# Altium schematic sheet RelayBypass.SchDoc
size A4; Author: Jeremiah Lilland; CompanyName: Pinebox Effects; DrawnBy: Jeremiah Lilland; Revision: 1.0
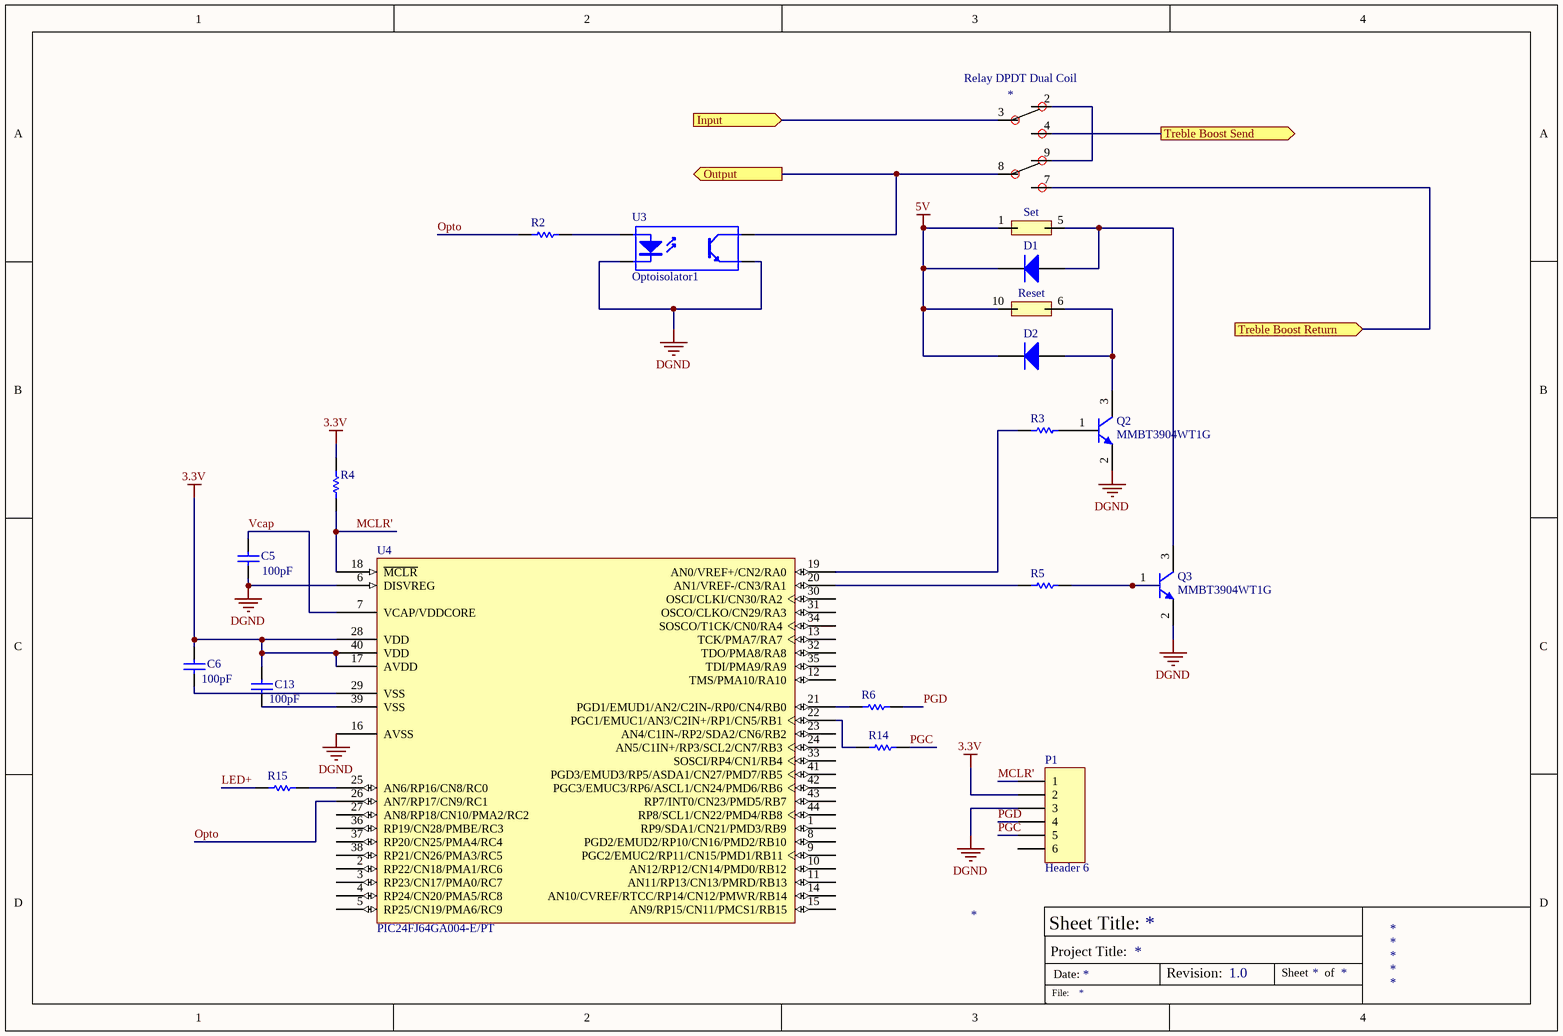
[diagram p0: RelayBypass.SchDoc]

## Parts
*  Relay DPDT Dual Coil  [EB2 Relay]
C5  value 100pF  [1210]  (hidden comment: C1210)
C6  value 100pF  [1206]  (hidden comment: C1206)
C13  value 100pF  [1206]  (hidden comment: C1206)
D1  Diode 1N4148  [DO-35]  (value not drawn)
D2  Diode 1N4148  [DO-35]  (value not drawn)
P1  Header 6  [HDR1X6]
Q2  MMBT3904WT1G  [ONSC-SC-70-3-419-04_V]
Q3  MMBT3904WT1G  [ONSC-SC-70-3-419-04_V]
R2  ERJ6BQ  [6-0805]  (value not drawn)
R3  ERJ6BQ  [6-0805]  (value not drawn)
R4  ERJ6BQ  [6-0805]  (value not drawn)
R5  ERJ6BQ  [6-0805]  (value not drawn)
R6  ERJ6BQ  [6-0805]  (value not drawn)
R14  ERJ6BQ  [6-0805]  (value not drawn)
R15  ERJ6BQ  [6-0805]  (value not drawn)
U3  Optoisolator1  [DIP-4]
U4  PIC24FJ64GA004-E/PT  [TQFP-PT44_N]

## Ports
Input (in), Output (out), Treble Boost Return (in), Treble Boost Send (out)

## Nets
3.3V: C6.2 C13.2 P1.2 R4.2 U4.17(AVDD) U4.28(VDD) U4.40(VDD)
5V: *.1 *.10 D1.2(K) D2.2(K)
DGND: C5.1 P1.3 Q2.2(E) Q3.2(E) U3.2(K) U3.3(E) U4.6(DISVREG) U4.16(AVSS)
Input: *.3 ; port Input
LED+: R15.2
MCLR': P1.1 R4.1 U4.18(~{MCLR})
Opto: R2.2 U4.26(AN7/RP17/CN9/RC1)
Output: *.8 U3.4(C) ; port Output
PGC: P1.5 R14.1
PGD: P1.4 R6.1
Treble Boost Return: *.7 ; port Treble Boost Return
Treble Boost Send: *.4 ; port Treble Boost Send
Vcap: C5.2 U4.7(VCAP/VDDCORE)
Net*_2: *.2 *.9
Net*_5: *.5 D1.1(A) Q3.3(C)
Net*_6: *.6 D2.1(A) Q2.3(C)
NetC6_1: C6.1 U4.29(VSS)
NetC13_1: C13.1 U4.39(VSS)
NetQ2_1: Q2.1(B) R3.1
NetQ3_1: Q3.1(B) R5.1
NetR2_1: R2.1 U3.1(A)
NetR3_2: R3.2 U4.19(AN0/VREF+/CN2/RA0)
NetR5_2: R5.2 U4.20(AN1/VREF-/CN3/RA1)
NetR6_2: R6.2 U4.21(PGD1/EMUD1/AN2/C2IN-/RP0/CN4/RB0)
NetR14_2: R14.2 U4.22(PGC1/EMUC1/AN3/C2IN+/RP1/CN5/RB1)
NetR15_1: R15.1 U4.25(AN6/RP16/CN8/RC0)

Not connected (* = marked no-connect by the designer): P1 6; U4 1(RP9/SDA1/CN21/PMD3/RB9) 2(RP22/CN18/PMA1/RC6) 3(RP23/CN17/PMA0/RC7) 4(RP24/CN20/PMA5/RC8) 5(RP25/CN19/PMA6/RC9) 8(PGD2/EMUD2/RP10/CN16/PMD2/RB10) 9(PGC2/EMUC2/RP11/CN15/PMD1/RB11) 10(AN12/RP12/CN14/PMD0/RB12) 11(AN11/RP13/CN13/PMRD/RB13) 12(TMS/PMA10/RA10) 13(TCK/PMA7/RA7) 14(AN10/CVREF/RTCC/RP14/CN12/PMWR/RB14) 15(AN9/RP15/CN11/PMCS1/RB15) 23(AN4/C1IN-/RP2/SDA2/CN6/RB2) 24(AN5/C1IN+/RP3/SCL2/CN7/RB3) 27(AN8/RP18/CN10/PMA2/RC2) 30(OSCI/CLKI/CN30/RA2) 31(OSCO/CLKO/CN29/RA3) 32(TDO/PMA8/RA8) 33(SOSCI/RP4/CN1/RB4) 34(SOSCO/T1CK/CN0/RA4) 35(TDI/PMA9/RA9) 36(RP19/CN28/PMBE/RC3) 37(RP20/CN25/PMA4/RC4) 38(RP21/CN26/PMA3/RC5) 41(PGD3/EMUD3/RP5/ASDA1/CN27/PMD7/RB5) 42(PGC3/EMUC3/RP6/ASCL1/CN24/PMD6/RB6) 43(RP7/INT0/CN23/PMD5/RB7) 44(RP8/SCL1/CN22/PMD4/RB8)

## Notes on the sheet
- Sheet Title:
- Project Title:
- Date:
- Revision:
- Sheet
- of
- File:
- (in symbol Relay DPDT Dual Coil) Set; Reset

## Library data of the parts
C5 = C1210: Ceramic Chip Capacitor - Standard; Published: 17-Jul-2002; LatestRevisionDate: 19-Mar-2004; LatestRevisionNote: Silkscreen size reduced.; DatasheetDocument: Mar-2001; PackageDocument: Mar-2001; PackageReference: 1210; Publisher: Altium Limited; Code_JEITA: 1210; Code_IPC: 3225 [1210]; ComponentLink1Description: Manufacturer Link; ComponentLink1URL: http://www.kemet.com/; ComponentLink2Description: Datasheet; ComponentLink2URL: http://www.kemet.com/kemet/web/homepage/kechome.nsf/vapubfilesname/F3102TA.pdf/$file/F3102TA.pdf
C6 C13 = C1206: Ceramic Chip Capacitor - Standard; Published: 17-Jul-2002; LatestRevisionDate: 19-Mar-2004; LatestRevisionNote: Silkscreen size reduced.; DatasheetDocument: Mar-2001; PackageDocument: Mar-2001; PackageReference: 1206; Publisher: Altium Limited; Code_JEITA: 1206; Code_IPC: 3216 [1206]; ComponentLink1Description: Manufacturer Link; ComponentLink1URL: http://www.kemet.com/; ComponentLink2Description: Datasheet; ComponentLink2URL: http://www.kemet.com/kemet/web/homepage/kechome.nsf/vapubfilesname/F3102TA.pdf/$file/F3102TA.pdf
D1 D2 = Diode 1N4148: High Conductance Fast Diode; Published: 8-Jun-2000; LatestRevisionDate: 17-Jul-2002; LatestRevisionNote: Re-released for DXP Platform.; DatasheetVersion: 1997; PackageReference: DO-35; Publisher: Altium Limited; PackageDescription: Diode, Axial; Body 3.8 x 1.9 mm (LxDia. max), Lead Dia. 0.53 mm (max); Code_JEDEC: DO-204-AH; ComponentLink1Description: Manufacturer Link; ComponentLink1URL: http://www.fairchildsemi.com/; ComponentLink2Description: Datasheet; ComponentLink2URL: http://www.fairchildsemi.com/ds/1N%2F1N4148.pdf
P1 = Header 6: Header, 6-Pin; LatestRevisionDate: 17-Jul-2002; LatestRevisionNote: Re-released for DXP Platform.; Publisher: Altium Limited
Q2 Q3 = MMBT3904WT1G: General Purpose Transistor, NPN Silicon, 3-Pin SC70, Pb-Free, Tape and Reel; Manufacturer: On Semiconductor; fT Min (MHz): 300; IC Continuous (A): 0.2; DatasheetVersion: Rev. 8; PackageVersion: Rev. N, 11/2008; PackageReference: SC-70-3-419-04; PackageDescription: 3-Pin Small Outline Transistor, Body 2 x 1.25 mm, Pitch 0.65 mm; Supplier 1: Digi-Key; Supplier Part Number 1: MMBT3904WT1GOSTR-ND; Supplier 2: Digi-Key; Supplier Part Number 2: MMBT3904WT1GOSCT-ND; Supplier 3: Digi-Key; Supplier Part Number 3: MMBT3904WT1GOSDKR-ND; Supplier 4: Farnell; Supplier Part Number 4: 1459102; Supplier 5: Farnell; Supplier Part Number 5: 2317829; Supplier 6: Farnell; Supplier Part Number 6: 1459102RL; Supplier 7: Newark; Supplier Part Number 7: 67R1339; Supplier 8: Newark; Supplier Part Number 8: 88H4788; Supplier 9: Mouser; Supplier Part Number 9: 863-MMBT3904WT1G; Packing: Tape and Reel; Polarity: NPN; RoHS: TRUE; Mounting Technology: Surface Mount; PartNumber: MMBT3904WT1G; ComponentLink1Description: Manufacturer URL; ComponentLink1URL: http://www.onsemi.com/; ComponentLink2Description: Datasheet; ComponentLink2URL: http://www.onsemi.cn/pub_link/Collateral/MMBT3904WT1-D.PDF; ComponentLink3Description: Package Specification; ComponentLink3URL: http://www.onsemi.cn/pub_link/Collateral/419-04.PDF
R2-R6 R14 R15 = ERJ6BQ: Low Ohmic Value Thick Film Chip Resistor, 0.22 Ohm to 9.1 Ohm Range, 1%, 2% and 5% Tolerance, 0805 Size, 0.25 W; Published: 17-Dec-2003; LatestRevisionDate: 19-Mar-2004; LatestRevisionNote: Silkscreen size reduced.; PackageReference: 6-0805; Publisher: Altium Limited; PackageDocument: Mar-2003; Code_IPC: 2012 [0805]; ComponentLink1Description: Manufacturer Link; ComponentLink1URL: http://www.panasonic.com/industrial/components/resistive_products.htm; ComponentLink2Description: Datasheet; ComponentLink2URL: http://www.panasonic.com/industrial/components/pdf/AOA0000CE3.pdf
U3 = Optoisolator1: 4-Pin Phototransistor Optocoupler; Published: 24-Mar-1999; LatestRevisionDate: 04-Mar-2005; LatestRevisionNote: Sch pins 3 & 4 Swapped.; DatasheetVersion: Nov-2003; PackageReference: DIP-4; Publisher: Altium Limited
U4 = PIC24FJ64GA004-E/PT: General Purpose 16-Bit Flash Microcontroller, 64KB Flash, 8KB SRAM, 44-Pin TQFP, Extended Temperature; Published: 2-Dec-2009; LatestRevisionDate: 07-Oct-2010; LatestRevisionNote: Updated to datasheet revision D, Feb-2010. Supplier links updated.; DatasheetVersion: revD, Feb-2010; PackageVersion: revBB, Aug-2009; PackageReference: TQFP-PT44; Publisher: Altium Limited; PackageDescription: 44-Lead Plastic Thin Quad Flatpack (PT) - 10x10x1mm Body, 2.00mm [TQFP]; Supplier 1: Digi-Key; Supplier Part Number 1: PIC24FJ64GA004-E/PT-ND; Supplier 2: Farnell; Supplier Part Number 2: 1788574; Code_JEDEC: MS-026; ComponentLink1Description: Datasheet; ComponentLink1URL: http://ww1.microchip.com/downloads/en/DeviceDoc/39881D.pdf; ComponentLink2Description: Packaging Specification; ComponentLink2URL: http://www.microchip.com/stellent/groups/techpub_sg/documents/packagingspec/en012702.pdf; ComponentLink3Description: Microchip.com Home; ComponentLink3URL: http://www.microchip.com/